# Altium schematic sheet PWM.SchDoc: PWM Connectors
size A3; Author: Valentin Py; DrawnBy: Valentin Py; Engineer: Valentin Py; Address1: valentin.py@gmail.com; SheetNumber: 5; SheetTotal: 5; PageSetup: Record=PageOptions|CenterHorizontal=True|CenterVertical=True|PrintScale=0.24|XCorrection=1.00|YCorrection=1.00|PrintKind=0|BorderSize=5000000|LeftOffset=0|BottomOffset=0|Orientation=2|PaperLength=1000|PaperWidth=1000|Scale=100|PaperSource=7|PrintQuality=-4|MediaType=1|DitherType=10|PaperKind=A4|PrintScaleMode=1
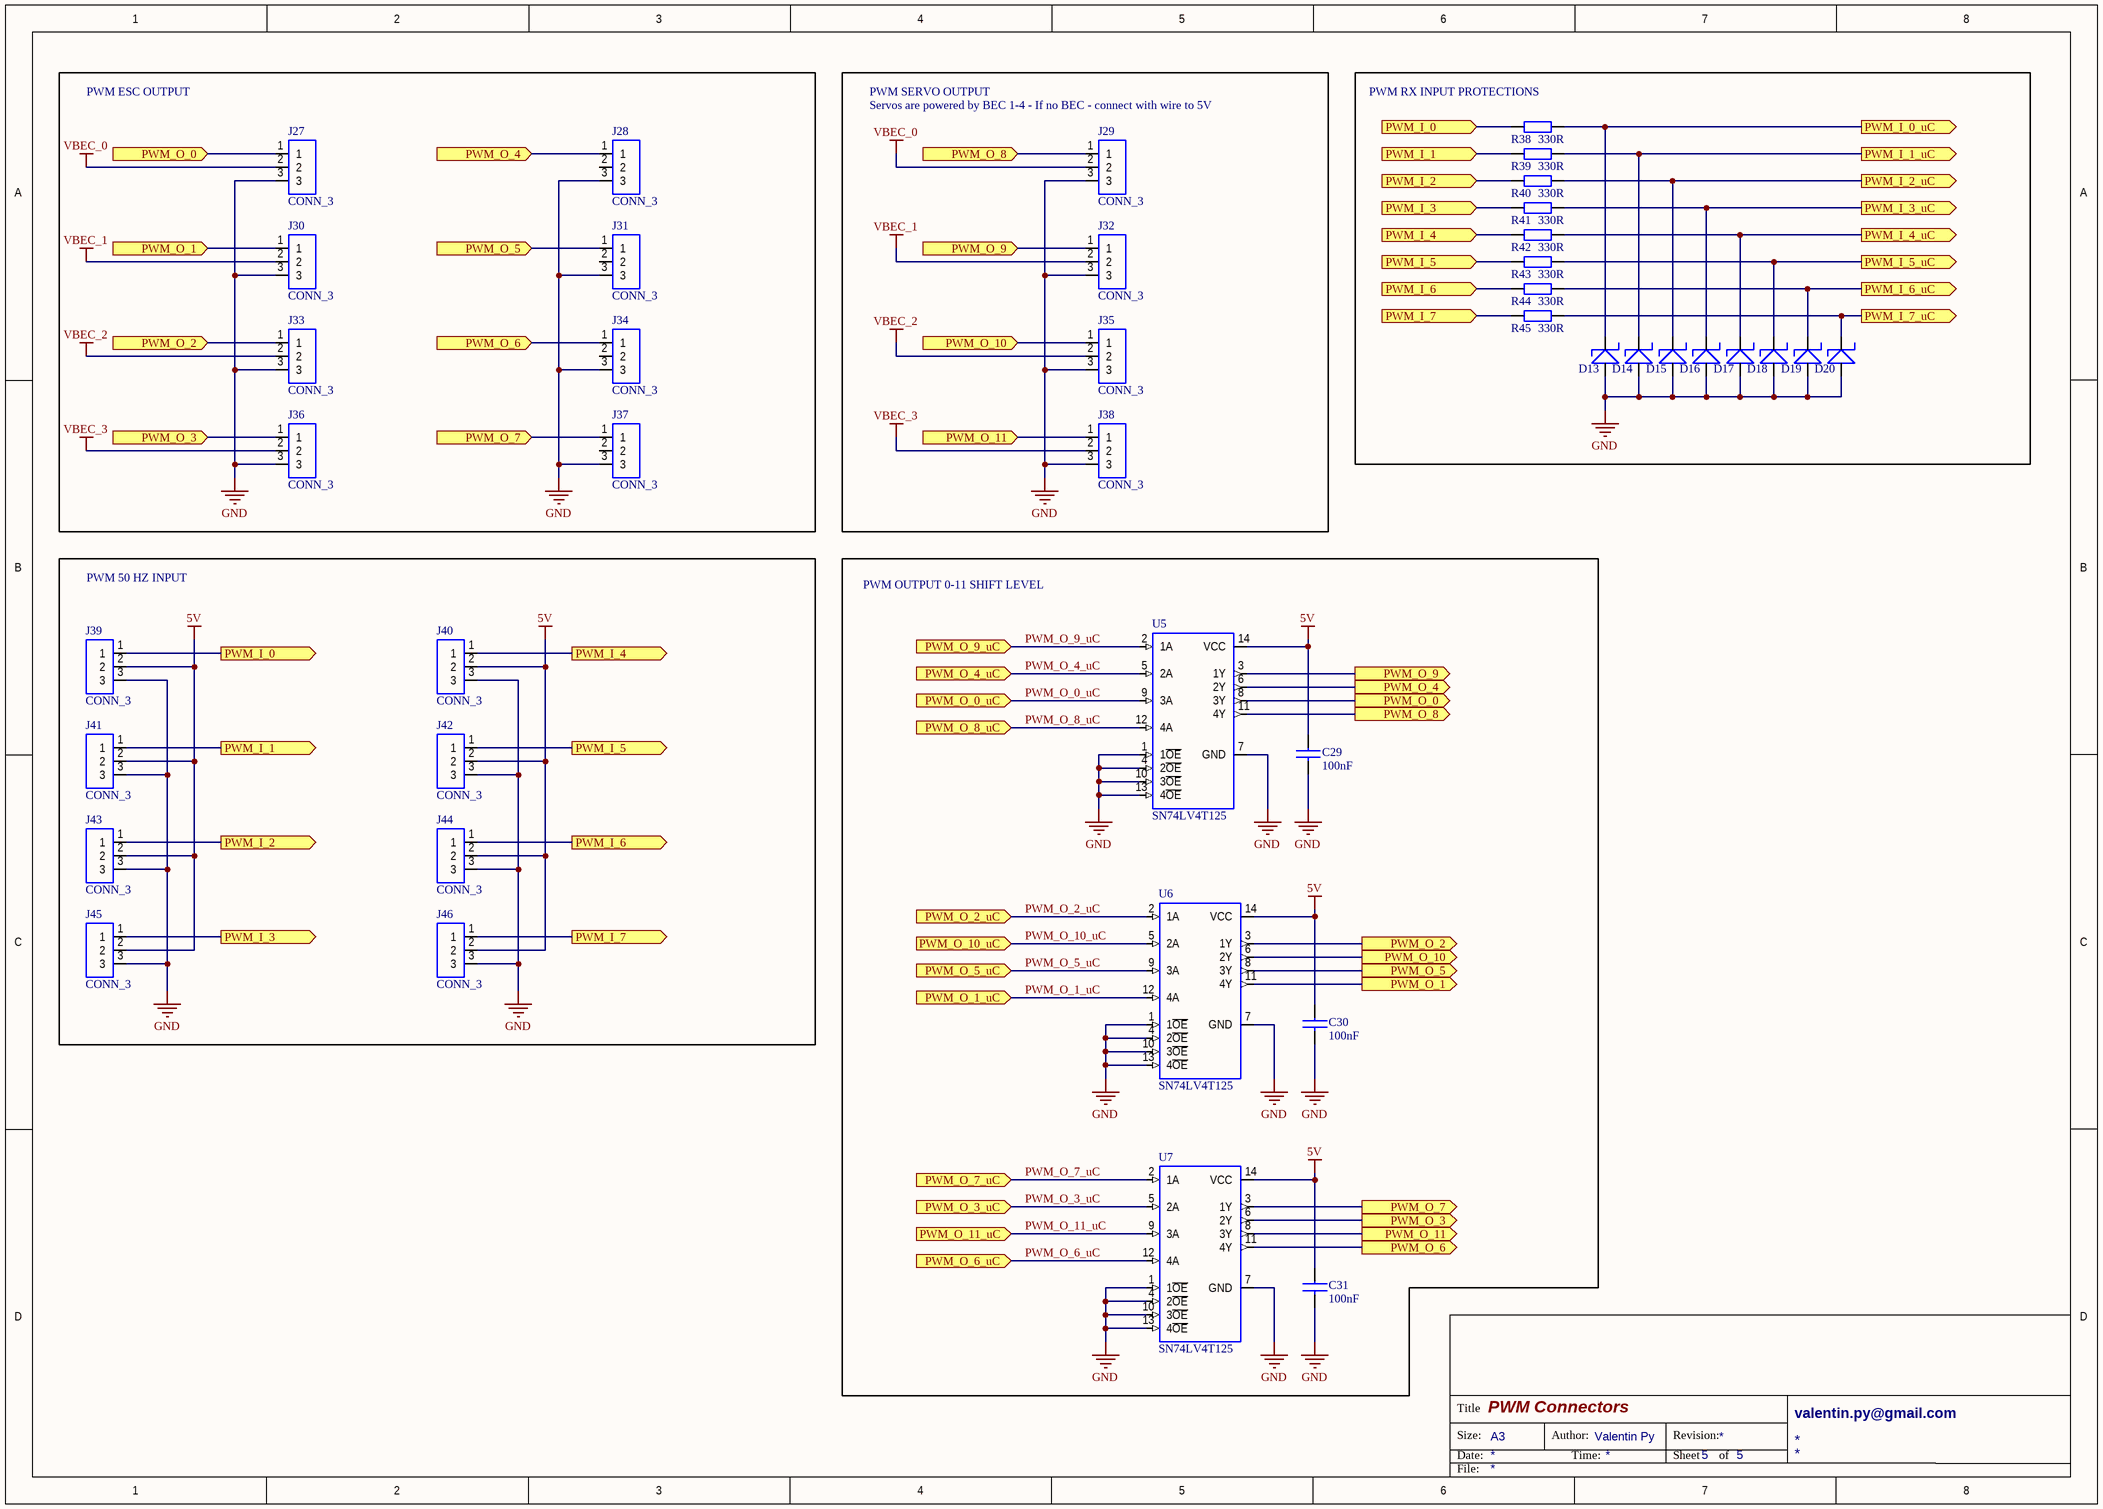
[diagram p0: PWM.SchDoc]

## Parts
C29  100nF  [080503]
C30  100nF  [080503]
C31  100nF  [080503]
D13  TVS DIODE 3.3V  [SOD-523]  (value not drawn)
D14  TVS DIODE 3.3V  [SOD-523]  (value not drawn)
D15  TVS DIODE 3.3V  [SOD-523]  (value not drawn)
D16  TVS DIODE 3.3V  [SOD-523]  (value not drawn)
D17  TVS DIODE 3.3V  [SOD-523]  (value not drawn)
D18  TVS DIODE 3.3V  [SOD-523]  (value not drawn)
D19  TVS DIODE 3.3V  [SOD-523]  (value not drawn)
D20  TVS DIODE 3.3V  [SOD-523]  (value not drawn)
J27  CONN_3  [640454-3]
J28  CONN_3  [640454-3]
J29  CONN_3  [640454-3]
J30  CONN_3  [640454-3]
J31  CONN_3  [640454-3]
J32  CONN_3  [640454-3]
J33  CONN_3  [640454-3]
J34  CONN_3  [640454-3]
J35  CONN_3  [640454-3]
J36  CONN_3  [640454-3]
J37  CONN_3  [640454-3]
J38  CONN_3  [640454-3]
J39  CONN_3  [640454-3]
J40  CONN_3  [640454-3]
J41  CONN_3  [640454-3]
J42  CONN_3  [640454-3]
J43  CONN_3  [640454-3]
J44  CONN_3  [640454-3]
J45  CONN_3  [640454-3]
J46  CONN_3  [640454-3]
R38  330R  [060301]
R39  330R  [060301]
R40  330R  [060301]
R41  330R  [060301]
R42  330R  [060301]
R43  330R  [060301]
R44  330R  [060301]
R45  330R  [060301]
U5  SN74LV4T125  [TSSOP14]
U6  SN74LV4T125  [TSSOP14]
U7  SN74LV4T125  [TSSOP14]

## Blocks framed on the sheet
PWM ESC OUTPUT: J27 J28 J30 J31 J33 J34 J36 J37
PWM RX INPUT PROTECTIONS: D13-D20 R38-R45
PWM 50 HZ INPUT: J39-J46
PWM OUTPUT 0-11 SHIFT LEVEL: C29-C31 U5-U7

## Ports
PWM_I_0 (in), PWM_I_0 (out), PWM_I_0_uC (out), PWM_I_1 (in), PWM_I_1 (out), PWM_I_1_uC (out), PWM_I_2 (in), PWM_I_2 (out), PWM_I_2_uC (out), PWM_I_3 (in), PWM_I_3 (out), PWM_I_3_uC (out), PWM_I_4 (in), PWM_I_4 (out), PWM_I_4_uC (out), PWM_I_5 (in), PWM_I_5 (out), PWM_I_5_uC (out), PWM_I_6 (in), PWM_I_6 (out), PWM_I_6_uC (out), PWM_I_7 (in), PWM_I_7 (out), PWM_I_7_uC (out), PWM_O_0 (in), PWM_O_0 (out), PWM_O_0_uC (in), PWM_O_1 (in), PWM_O_1 (out), PWM_O_1_uC (in), PWM_O_2 (in), PWM_O_2 (out), PWM_O_2_uC (in), PWM_O_3 (in), PWM_O_3 (out), PWM_O_3_uC (in), PWM_O_4 (in), PWM_O_4 (out), PWM_O_4_uC (in), PWM_O_5 (in), PWM_O_5 (out), PWM_O_5_uC (in), PWM_O_6 (in), PWM_O_6 (out), PWM_O_6_uC (in), PWM_O_7 (in), PWM_O_7 (out), PWM_O_7_uC (in), PWM_O_8 (in), PWM_O_8 (out), PWM_O_8_uC (in), PWM_O_9 (in), PWM_O_9 (out), PWM_O_9_uC (in), PWM_O_10 (in), PWM_O_10 (out), PWM_O_10_uC (in), PWM_O_11 (in), PWM_O_11 (out), PWM_O_11_uC (in)

## Nets
5V: C29.1 C30.1 C31.1 J39.2 J40.2 J41.2 J42.2 J43.2 J44.2 J45.2 J46.2 U5.14(VCC) U6.14(VCC) U7.14(VCC)
GND: C29.2 C30.2 C31.2 D13.1 D14.1 D15.1 D16.1 D17.1 D18.1 D19.1 D20.1 J27.3 J28.3 J29.3 J30.3 J31.3 J32.3 J33.3 J34.3 J35.3 J36.3 J37.3 J38.3 J39.3 J40.3 J41.3 J42.3 J43.3 J44.3 J45.3 J46.3 U5.1(1~{OE}) U5.4(2~{OE}) U5.7(GND) U5.10(3~{OE}) U5.13(4~{OE}) U6.1(1~{OE}) U6.4(2~{OE}) U6.7(GND) U6.10(3~{OE}) U6.13(4~{OE}) U7.1(1~{OE}) U7.4(2~{OE}) U7.7(GND) U7.10(3~{OE}) U7.13(4~{OE})
VBEC_0: J27.2 J29.2
VBEC_1: J30.2 J32.2
VBEC_2: J33.2 J35.2
VBEC_3: J36.2 J38.2
PWM_I_0: J39.1 R38.2 ; port PWM_I_0
PWM_I_0_uC: D13.2 R38.1 ; port PWM_I_0_uC
PWM_I_1: J41.1 R39.2 ; port PWM_I_1
PWM_I_1_uC: D14.2 R39.1 ; port PWM_I_1_uC
PWM_I_2: J43.1 R40.2 ; port PWM_I_2
PWM_I_2_uC: D15.2 R40.1 ; port PWM_I_2_uC
PWM_I_3: J45.1 R41.2 ; port PWM_I_3
PWM_I_3_uC: D16.2 R41.1 ; port PWM_I_3_uC
PWM_I_4: J40.1 R42.2 ; port PWM_I_4
PWM_I_4_uC: D17.2 R42.1 ; port PWM_I_4_uC
PWM_I_5: J42.1 R43.2 ; port PWM_I_5
PWM_I_5_uC: D18.2 R43.1 ; port PWM_I_5_uC
PWM_I_6: J44.1 R44.2 ; port PWM_I_6
PWM_I_6_uC: D19.2 R44.1 ; port PWM_I_6_uC
PWM_I_7: J46.1 R45.2 ; port PWM_I_7
PWM_I_7_uC: D20.2 R45.1 ; port PWM_I_7_uC
PWM_O_0: J27.1 U5.8(3Y) ; port PWM_O_0
PWM_O_0_uC: U5.9(3A) ; port PWM_O_0_uC
PWM_O_1: J30.1 U6.11(4Y) ; port PWM_O_1
PWM_O_1_uC: U6.12(4A) ; port PWM_O_1_uC
PWM_O_2: J33.1 U6.3(1Y) ; port PWM_O_2
PWM_O_2_uC: U6.2(1A) ; port PWM_O_2_uC
PWM_O_3: J36.1 U7.6(2Y) ; port PWM_O_3
PWM_O_3_uC: U7.5(2A) ; port PWM_O_3_uC
PWM_O_4: J28.1 U5.6(2Y) ; port PWM_O_4
PWM_O_4_uC: U5.5(2A) ; port PWM_O_4_uC
PWM_O_5: J31.1 U6.8(3Y) ; port PWM_O_5
PWM_O_5_uC: U6.9(3A) ; port PWM_O_5_uC
PWM_O_6: J34.1 U7.11(4Y) ; port PWM_O_6
PWM_O_6_uC: U7.12(4A) ; port PWM_O_6_uC
PWM_O_7: J37.1 U7.3(1Y) ; port PWM_O_7
PWM_O_7_uC: U7.2(1A) ; port PWM_O_7_uC
PWM_O_8: J29.1 U5.11(4Y) ; port PWM_O_8
PWM_O_8_uC: U5.12(4A) ; port PWM_O_8_uC
PWM_O_9: J32.1 U5.3(1Y) ; port PWM_O_9
PWM_O_9_uC: U5.2(1A) ; port PWM_O_9_uC
PWM_O_10: J35.1 U6.6(2Y) ; port PWM_O_10
PWM_O_10_uC: U6.5(2A) ; port PWM_O_10_uC
PWM_O_11: J38.1 U7.8(3Y) ; port PWM_O_11
PWM_O_11_uC: U7.9(3A) ; port PWM_O_11_uC

Not connected (* = marked no-connect by the designer): J28 2; J31 2; J34 2; J37 2

## Notes on the sheet
- PWM SERVO OUTPUT
- (near J29) Servos are powered by BEC 1-4 - If no BEC - connect with wire to 5V
- Title
- Size:
- Date:
- A3
- Author:
- Time:
- Revision:
- Sheet
- of
- File:

## Library data of the parts
C29-C31 = CAPA: CAP CER 0.1UF 25V 10% X7R 0805; Value: 100nF; Supplier 1: Digi-Key; Supplier Part Number 1: 1276-1099-1-ND
D13-D20 = Zener: TVS DIODE 3.3VWM 8VC SOD523; Supplier 1: Digi-Key; Supplier Part Number 1: 641-1395-1-ND
J27-J46 = CONN_3: CONN HEADER 2.54mm 3; Supplier 1: Stock
R38-R45 = RES: RES 330R 0805; Value: 330R; Supplier 1: Digi-Key; Supplier Part Number 1: RHM330CFCT-ND
U5-U7 = SN74LV4T125: IC BUFF/DVR NON-INVERT 14TSSOP; Supplier 1: Digi-Key; Supplier Part Number 1: 296-40545-1-ND